# EAGLE schematic nRF24L01_SMD_0603 (EAGLE 9.6.2)
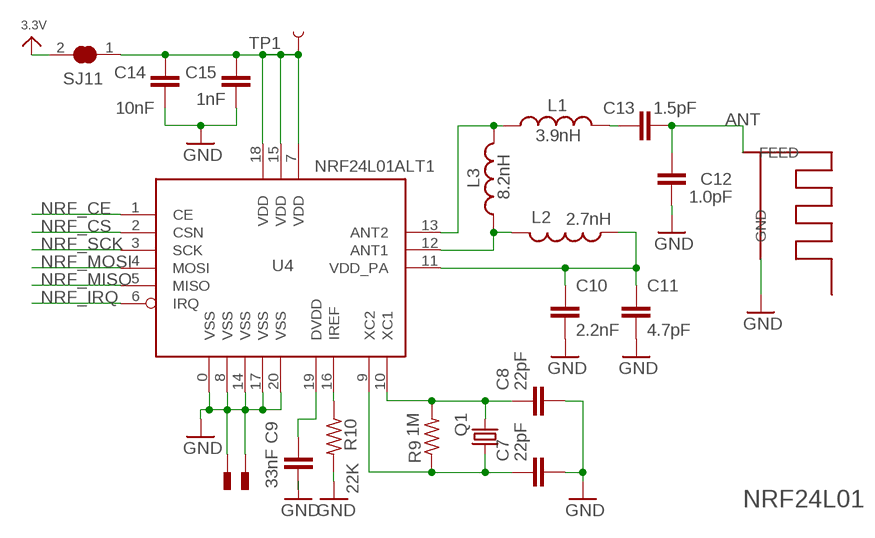
[diagram p0: schematic, sheet 1]

## Parts
ANT2  NRF24L01_ANTENNA  [NRF24L01_ANT]
C7  22pF  C-EUC0603  [C0603]
C8  22pF  C-EUC0603  [C0603]
C9  33nF  C-EUC0603  [C0603]
C10  2.2nF  C-EUC0603  [C0603]
C11  4.7pF  C-EUC0603  [C0603]
C12  1.0pF  C-EUC0603  [C0603]
C13  1.5pF  C-EUC0603  [C0603]
C14  10nF  C-EUC0603  [C0603]
C15  1nF  C-EUC0603  [C0603]
L1  3.9nH  L-USL0603  [L0603]
L2  2.7nH  L-USL0603  [L0603]
L3  8.2nH  L-USL0603  [L0603]
Q1  KX-7  [3.2X2.5_KX-7]
R9  1M  R-US_R0603  [R0603]
R10  22K  R-US_R0603  [R0603]
SJ11  SOLDERJUMPER_CLOSED  [SOLDERJUMPER_CLOSEDWIRE]
TP1  TEST-POINT3X5  [PAD.03X.05]
U4  NRF24L01ALT1  [QFN20_ALT1]
U$27  PAD  [PAD-0.008]
U$28  PAD  [PAD-0.008]

## Nets
3.3V: SJ11.2
ANT: ANT2.FEED C12.2 C13.2
GND: ANT2.GND C7.2 C8.2 C9.2 C10.2 C11.2 C12.1 C14.1 C15.1 R10.2 U4.0(VSS) U4.8(VSS) U4.14(VSS) U4.17(VSS) U4.20(VSS) U$27.P$1 U$28.P$1
N$1: C14.2 C15.2 SJ11.1 TP1.P$1 U4.7(VDD) U4.15(VDD) U4.18(VDD)
N$3: C7.1 Q1.1 R9.1 U4.9(XC2)
N$8: C8.1 Q1.3 R9.2 U4.10(XC1)
N$9: L1.1 L3.2 U4.13(ANT2)
N$10: C10.1 C11.1 L2.1 U4.11(VDD_PA)
N$11: R10.1 U4.16(IREF)
N$12: C9.1 U4.19(DVDD)
N$13: L2.2 L3.1 U4.12(ANT1)
N$14: C13.1 L1.2
NRF_CE: U4.1(CE)
NRF_CS: U4.2(CSN)
NRF_IRQ: U4.6(IRQ)
NRF_MISO: U4.5(MISO)
NRF_MOSI: U4.4(MOSI)
NRF_SCK: U4.3(SCK)

## Notes on the sheet
- NRF24L01

## Library data of the parts
ANT2 = NRF24L01_ANTENNA:NRF24L01_ANTENNA
C7-C15 = rcl:C-EU: CAPACITOR, European symbol; SPICEPREFIX: C
L1-L3 = rcl-2:L-US: INDUCTOR, American symbol
Q1 = crystal-geyer_V1_0:KX: Quartz Crystals (MHz) SMD: KX - Serie Model Size l/w/h [mm] Frequency Range Frequency Stability Temp. Range [°C] Load Capacitance AECQ 200 availabel Datasheet KX-4 KX-5 KX-6 KX-7 KX-9A KX-9B KX-12A KX-12B KX-13 KX-20 KX-K KX-KS 1.6/1.2/0.3 2.0/1.6/0.45 2.5/2.0/0.55 3.2/2.5/0.8 5.0/3.2/1.0 5.0/3.2/1.1 6.0/3.5/1.1 6.0/3.5/1.0 7.0/5.0 /1.3 11.6/5.5/1.6 12.3/4.5/4.2 12.3/4.5/3.2 24.0 ~ 80.0 MHz 16.0 ~ 80.0 MHz 12.0 ~ 80.0 MHz 8.0 ~ 60.0 MHz 7,68 ~ 300,0 MHz 8,0 ~ 50,0 MHz 8,0 ~ 150,0 MHz 8,0 ~ 50,0 MHz 6,0 ~ 160,0 MHz 3,579 ~ 25,0 MHz 3,579 ~ 70,0 MHz 3,579 ~ 70,0 MHz ±10 … ±50ppm ±10 … ±50ppm ±10 … ±50ppm ±10 … ±50ppm ±10 … ±50ppm ±10 … ±50ppm ±10 … ±50ppm ±10 … ±50ppm ±10 … ±50ppm ±50ppm ±10 … ±50ppm ±10 … ±50ppm (*) -40°C …+85°C (*) -40°C …+125°C (*) -40°C …+125°C (*) -40°C …+125°C (*) -40°C …+105°C (*) -40°C …+105°C (*) -40°C …+125°C (*) -40°C …+105°C (*) -40°C …+105°C (*) -40°C …+105°C (*) -40°C …+85°C (*) -40°C …+85°C 8, 8…16 8, 8…16 10, 8…16 12, 7…20 16, 10…20 16, 10…20 16, 10…20 16, 12…20 16, 12…20 16, 12…20 16, 12…30 16, 12…30 - yes yes yes - - - - - - - - KX-4.pdf <http://www.geyer-electronic.de/uploads/tx_userartikelfrequenz/GEYER-KX-4.pdf> KX-5.pdf <http://www.geyer-electronic.de/uploads/tx_userartikelfrequenz/GEYER-KX-5.pdf> KX-6.pdf <http://www.geyer-electronic.de/uploads/tx_userartikelfrequenz/GEYER-KX-6.pdf> KX-7.pdf <http://www.geyer-electronic.de/uploads/tx_userartikelfrequenz/GEYER-KX-7.pdf> KX-9A.pdf <http://www.geyer-electronic.de/uploads/tx_userartikelfrequenz/GEYER-KX-9A.pdf> KX-9B.pdf <http://www.geyer-electronic.de/uploads/tx_userartikelfrequenz/GEYER-KX-9B.pdf> KX-12A.pdf <http://www.geyer-electronic.de/uploads/tx_userartikelfrequenz/GEYER-KX-12A.pdf> KX-12B.pdf <http://www.geyer-electronic.de/uploads/tx_userartikelfrequenz/GEYER-KX-12B.pdf> KX-13.pdf <http://www.geyer-electronic.de/uploads/tx_userartikelfrequenz/GEYER-KX-13.pdf> KX-20.pdf <http://www.geyer-electronic.de/uploads/tx_userartikelfrequenz/GEYER-KX-20.pdf> KX-K.pdf <http://www.geyer-electronic.de/uploads/tx_userartikelfrequenz/GEYER-KX-K.pdf> KX-KS.pdf <http://www.geyer-electronic.de/uploads/tx_userartikelfrequenz/GEYER-KX-KS.pdf> <http://www.geyer-electronic.de/fileadmin/template/img/logo-geyer-electronic.png> Details see: http://www.geyer-electronic.de/Frequenz-Produkte.9.0.html Created 2016-06-07, Hans Locher 2016 (C) Geyer Quartz Technology KX4,KX5,KX6,KX7,KX9A,KX9B,KX12A,KX12B,KX13,KX20,KXK,KXKS;1612;2016;2520;3225;5032;6035;7050;11655;12345;1,6x1,2;2,0x1,6;2,5x2,0;3,2x2,5;5,0x3,2;6,0x3,5;7,0x5,0;11,6x5,5;12,3x4,5;12,3x4,5;1.6x1.2;2.0x1.6;2.5x2.0;3.2x2.5;5.0x3.2;6.0x3.5;7.0x5.0;11.6x5.5;12.3x4.5;12.3x4.5;
R9 R10 = rcl:R-US_: RESISTOR, American symbol; SPICEPREFIX: R
SJ11 = microbuilder:SOLDERJUMPER_CLOSED: Solder Jumper - Closed These solder jumpers are closed by default CLOSEDWIRE - 10 mil trace between pads that can be cut and resoldered later CLOSEDPERM - 63 mil trace between pads for a permanent connection (used to 'bridge' two signals, a shameless hack for Eagle). Can double as a test point as well (no cream layer)
TP1 = SparkFun:TEST-POINT
U4 = Testing:NRF24L01: 2.4GHz Low Power Transceiver This is the very popular, low cost, very low power RF transceiver from Nordic Semiconductor. Simple SPI interface. SKU: COM-00690
U$27 U$28 = Testing:PAD